# EAGLE design Science Fair Project (EAGLE 9.2.2)
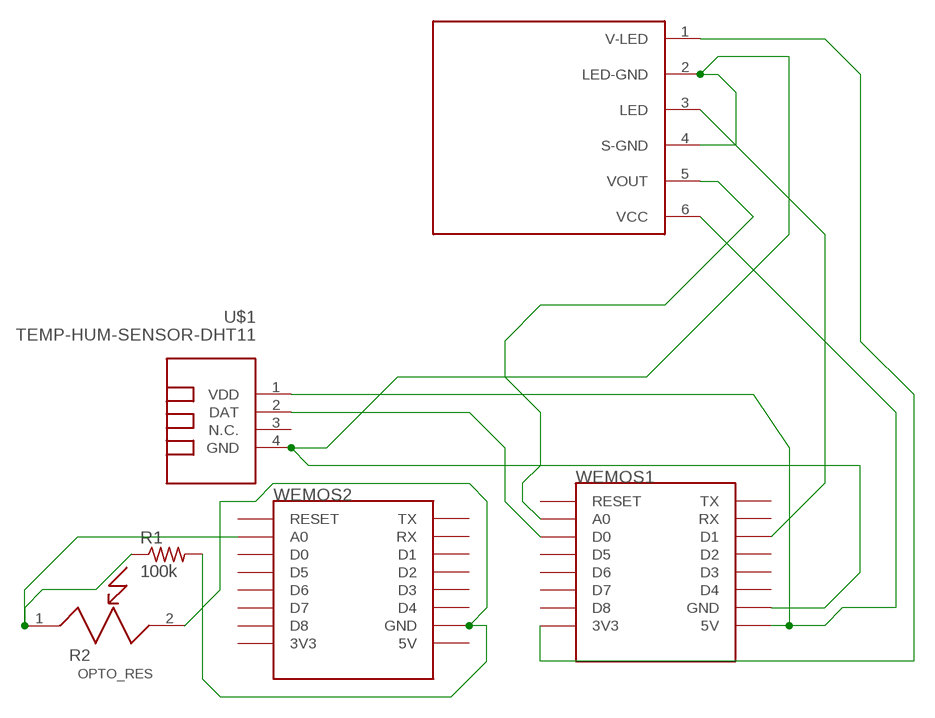
[diagram p0: schematic, sheet 1]

## Parts
R1  100k  R-US_0411/15  [0411/15]
R2  OPTO_RES  [OPTO_RES]
U$1  TEMP-HUM-SENSOR-DHT11  [TEMP-HUM-SENSOR-DHT11]
U$2  GP2Y1010AU  [GP2Y1010AU]
WEMOS1  WEMOS-D1-MINI  [WEMOS-D1-MINI]
WEMOS2  WEMOS-D1-MINI  [WEMOS-D1-MINI]

## Nets
N$1: U$1.4(GND) U$2.2(LED-GND) U$2.4(S-GND) WEMOS1.GND
N$2: R1.2 R2.2 WEMOS2.GND
N$3: U$1.2(DAT) WEMOS1.D0
N$4: U$2.1(V-LED) WEMOS1.3V3
N$5: U$2.5(VOUT) WEMOS1.A0
N$6: U$1.1(VDD) U$2.6(VCC) WEMOS1.5V
N$7: U$2.3(LED) WEMOS1.D1
N$8: R1.1 R2.1 WEMOS2.A0
Unconnected: U$1.3(N.C.) WEMOS1.D2 WEMOS1.D3 WEMOS1.D4 WEMOS1.D5 WEMOS1.D6 WEMOS1.D7 WEMOS1.D8 WEMOS1.RESET WEMOS1.RX WEMOS1.TX WEMOS2.3V3 WEMOS2.5V WEMOS2.D0 WEMOS2.D1 WEMOS2.D2 WEMOS2.D3 WEMOS2.D4 WEMOS2.D5 WEMOS2.D6 WEMOS2.D7 WEMOS2.D8 WEMOS2.RESET WEMOS2.RX WEMOS2.TX

## Library data of the parts
R1 = rcl:R-US_: RESISTOR, American symbol; SPICEPREFIX: R
R2 = opto-resistor:OPTO_RES
U$1 = diy-modules:TEMP-HUM-SENSOR-DHT11: DHT11 - digital humidity & temperature sensor DHT11 datasheet available here: https://akizukidenshi.com/download/ds/aosong/DHT11.pdf Click here to find device on ebay.com <http://www.ebay.com/sch/dht11+digital+sensor>
U$2 = gp2y1010au:GP2Y1010AU: GP2Y1010AU0F is a dust sensor by optical sensing system. An infrared emitting diode (IRED) and an phototransistor are diagonally arranged into this device. It detects the reflected light of dust in air. Especially, it is effective to detect very fine particle like the cigarette smoke. In addition it can distinguish smoke from house dust by pulse pattern of output voltage. 1. Compact, thin package (46.0 × 30.0 × 17.6 mm) 2. Low consumption current (Icc: MAX. 20 mA) 3. The presence of dust can be detected by the photometry of only one pulse
WEMOS1 WEMOS2 = esp8266modules:WEMOS-D1-MINI: WeMos.cc D1 mini ESP8266 module

## Board
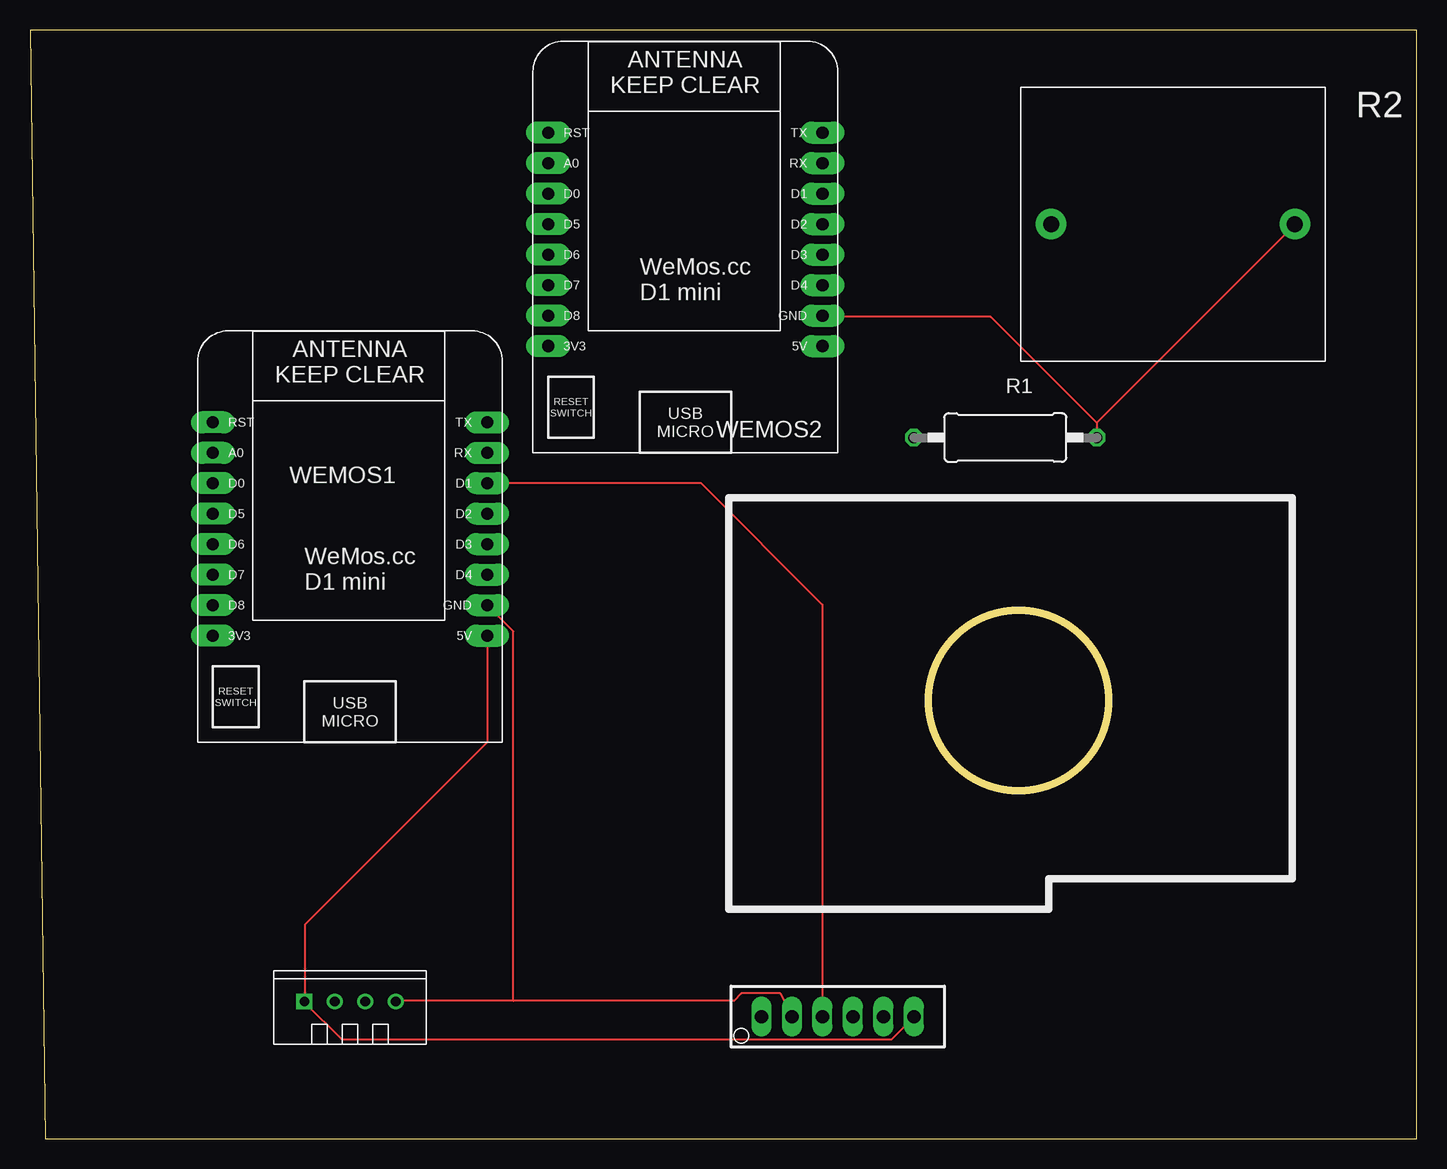
[diagram p1: board, top side]
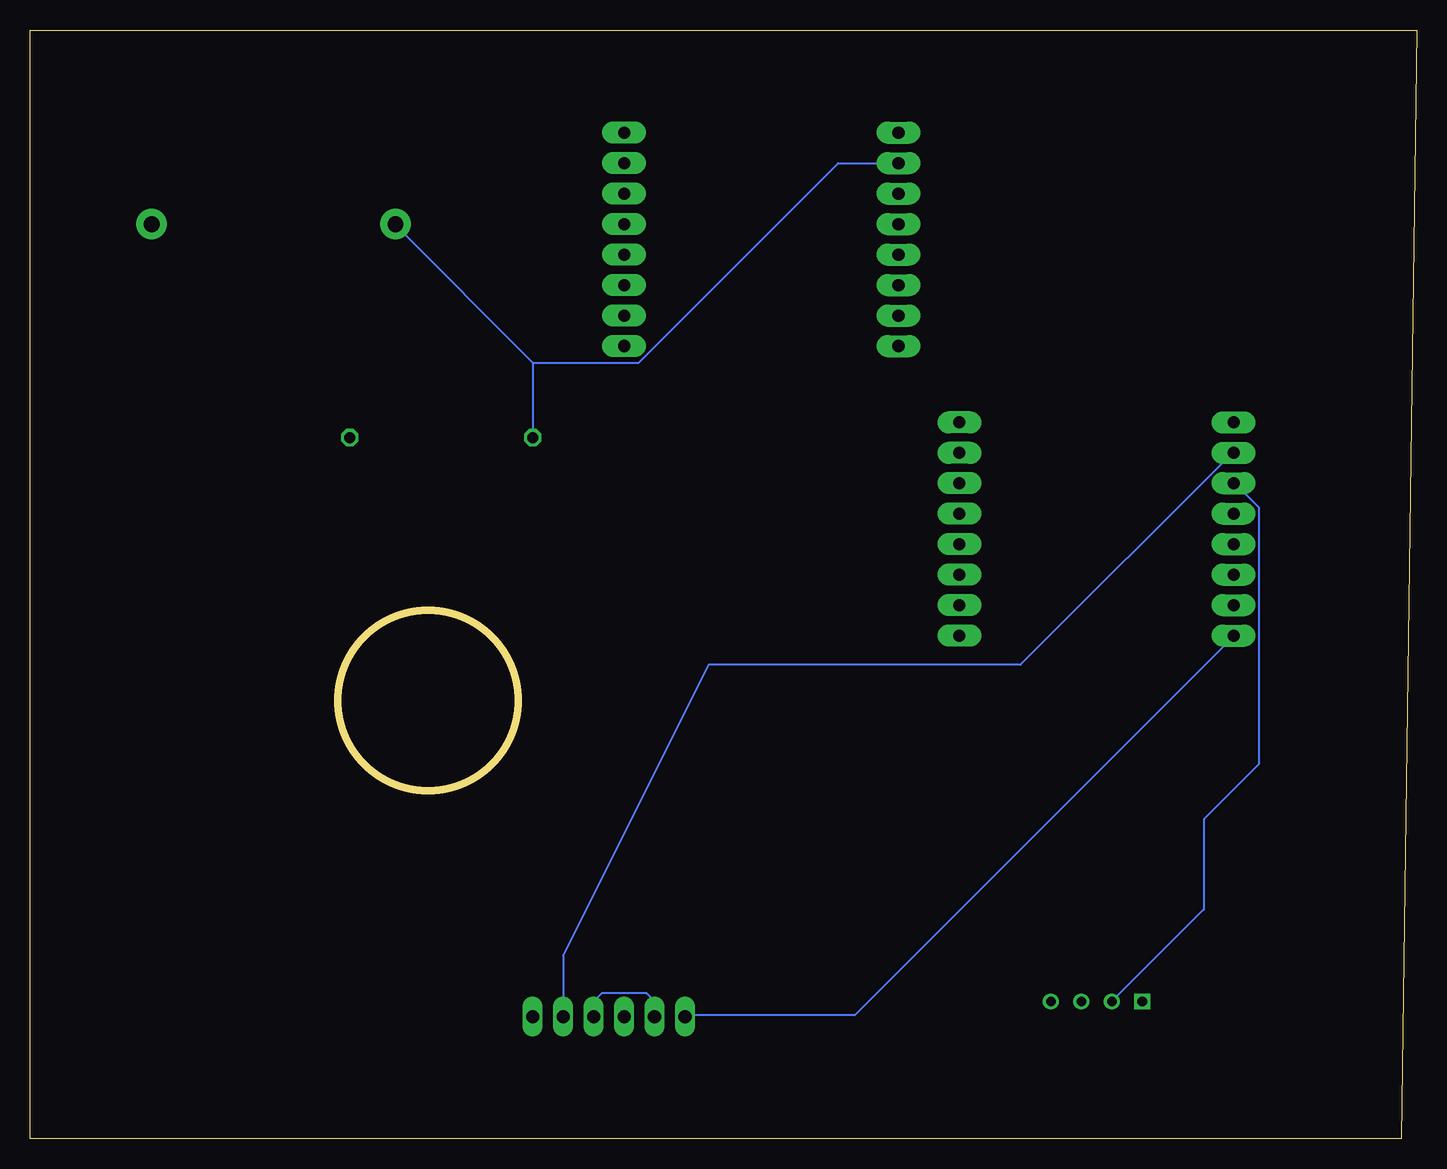
[diagram p2: board, bottom side, seen from below]

Size 115.55 x 92.38 mm. Coordinates in mm from the lower left corner, seen from the top.
Outline: 1.27,0 115.55,0 115.55,92.38 0,92.38 1.27,0
Copper layers (1*16): Top 0.035mm / dielectric 1.5mm / Bottom 0.035mm
Design rules "default": minimum track width 6mil, minimum drill 0.35mm, track to track 6mil, track to pad 6mil, pad to pad 6mil, via to via 6mil, smd to smd 6mil, copper to edge 40mil, drill to drill 6mil, minimum pad ring 10mil, minimum via ring 8mil, stop-mask expansion 4mil, vias tented up to drill 0mil, thermal gap 10mil

### Footprints (pad centres in the part's own frame; a part is rotated, then mirrored left to right if it is on the bottom)
0411/15 = drill 0.914 octagon: 1 -7.62,0; 2 7.62,0
OPTO_RES = drill 1.321 pad 2.54: 1 -10.16,0; 2 10.16,0
TEMP-HUM-SENSOR-DHT11 = drill 0.8 square: 1 -3.81,0 | drill 0.8: 2 -1.27,0; 3 1.27,0; 4 3.81,0
GP2Y1010AU = drill 1.1 long: 1 -27.94,5.08; 2 -25.4,5.08; 3 -22.86,5.08; 4 -20.32,5.08; 5 -17.78,5.08; 6 -15.24,5.08 | hole 15: -6.545,31.398
WEMOS-D1-MINI = drill 1.016 pad 1.829 long: 3V3 -10.16,-10.16; 5V 12.7,-10.16; A0 -10.16,5.08; D0 -10.16,2.54; D1 12.7,2.54; D2 12.7,0; D3 12.7,-2.54; D4 12.7,-5.08; D5 -10.16,0; D6 -10.16,-2.54; D7 -10.16,-5.08; D8 -10.16,-7.62; GND 12.7,-7.62; RESET -10.16,7.62; RX 12.7,5.08; TX 12.7,7.62

### Placement (x,y rotation side)
R1  81.28,58.42 0 top
R2  95.25,76.2 0 top
U$1  26.67,11.43 0 top
U$2  88.9,5.08 0 top
WEMOS1  25.4,52.07 0 top
WEMOS2  53.34,76.2 0 top

### Tracks (layer width: path | path; a pad name or v marks a point on that pad's centre or on a via)
N$1
  Top 0.152: 40.28,11.48 58.67,11.48 59.28,12.09 62.54,12.09 U$2.2 | 40.28,11.48 30.53,11.48 U$1.4 | WEMOS1.GND 40.28,42.27 40.28,11.48
  Bottom 0.152: U$2.4 68.58,11.43 67.92,12.09 64.16,12.09 63.5,11.43 U$2.2
N$2
  Top 0.152: 88.9,59.64 R1.2 | 88.9,59.64 105.36,76.1 R2.2 | 88.9,59.64 80.06,68.48 66.04,68.48 WEMOS2.GND
N$3
  Bottom 0.152: U$1.2 17.73,19.1 17.73,26.62 13.16,31.19 13.16,52.63 15.14,54.61 WEMOS1.D0
N$4
  Bottom 0.152: U$2.1 60.86,10.26 46.84,10.26 15.29,41.81 WEMOS1.3V3
N$5
  Bottom 0.152: U$2.5 71.12,15.24 59,39.47 33.02,39.47 15.29,57.2 WEMOS1.A0
N$6
  Top 0.152: WEMOS1.5V 38.1,33.02 22.91,17.83 22.91,11.48 U$1.1 22.91,11.33 25.96,8.28 71.83,8.28 73.66,10.11 U$2.6
N$7
  Top 0.152: U$2.3 66.04,44.5 55.93,54.61 WEMOS1.D1
N$8
  Bottom 0.152: 73.66,64.67 R1.1 | 73.66,64.67 85.09,76.1 R2.1 | WEMOS2.A0 48.21,81.28 64.82,64.67 73.66,64.67